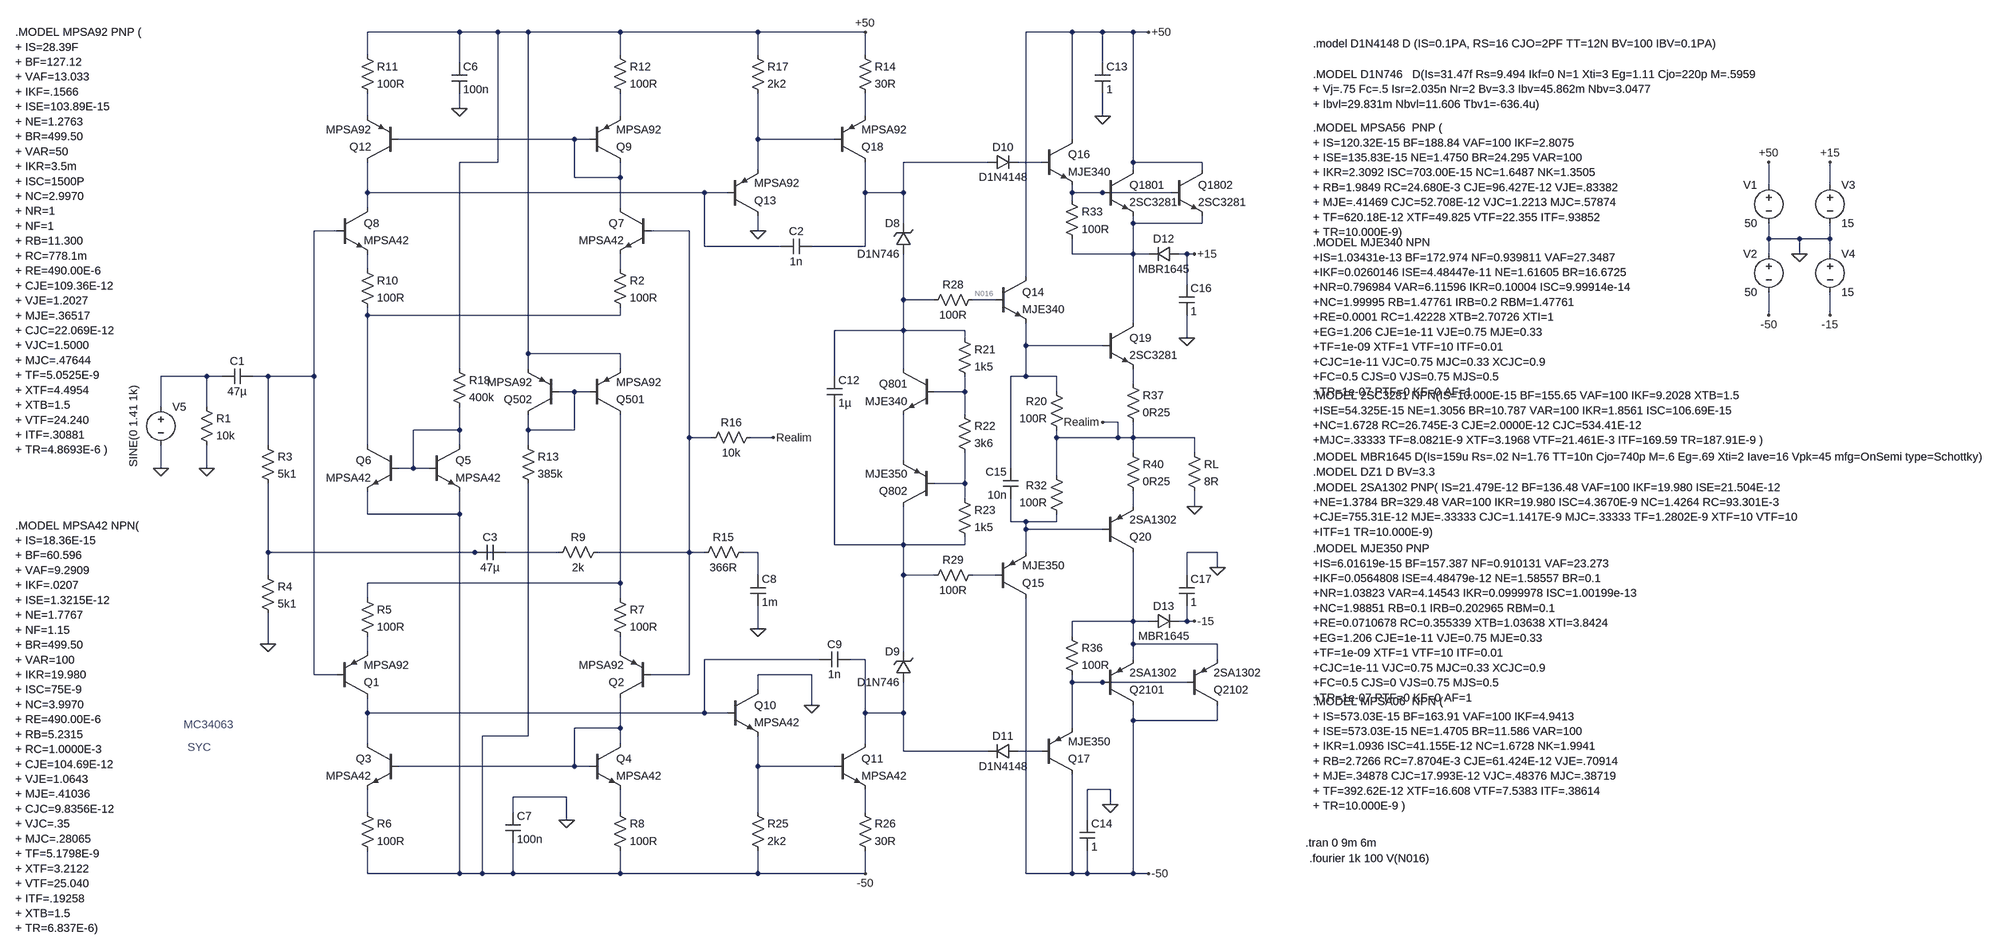
[diagram p0: schematic Clase G doble par fuente espejo.asc]
Clase G doble par fuente espejo.asc, the LTspice schematic file:
Version 4
SHEET 1 4608 680
WIRE 832 -1584 640 -1584
WIRE 912 -1584 832 -1584
WIRE 976 -1584 912 -1584
WIRE 1168 -1584 976 -1584
WIRE 1456 -1584 1168 -1584
WIRE 1680 -1584 1456 -1584
WIRE 2112 -1584 2016 -1584
WIRE 2176 -1584 2112 -1584
WIRE 2240 -1584 2176 -1584
WIRE 2272 -1584 2240 -1584
WIRE 640 -1536 640 -1584
WIRE 1168 -1536 1168 -1584
WIRE 1456 -1536 1456 -1584
WIRE 1680 -1536 1680 -1584
WIRE 832 -1520 832 -1584
WIRE 2176 -1520 2176 -1584
WIRE 832 -1424 832 -1456
WIRE 640 -1408 640 -1456
WIRE 1168 -1408 1168 -1456
WIRE 1680 -1408 1680 -1456
WIRE 2176 -1408 2176 -1456
WIRE 1072 -1360 704 -1360
WIRE 1104 -1360 1072 -1360
WIRE 1456 -1360 1456 -1456
WIRE 1616 -1360 1456 -1360
WIRE 2112 -1360 2112 -1584
WIRE 912 -1312 912 -1584
WIRE 912 -1312 832 -1312
WIRE 1936 -1312 1760 -1312
WIRE 2048 -1312 2000 -1312
WIRE 2240 -1312 2240 -1584
WIRE 2384 -1312 2240 -1312
WIRE 1456 -1296 1456 -1360
WIRE 2240 -1296 2240 -1312
WIRE 2384 -1296 2384 -1312
WIRE 1072 -1280 1072 -1360
WIRE 1168 -1280 1168 -1312
WIRE 1168 -1280 1072 -1280
WIRE 3568 -1264 3568 -1312
WIRE 3696 -1264 3696 -1312
WIRE 640 -1248 640 -1312
WIRE 1344 -1248 640 -1248
WIRE 1392 -1248 1344 -1248
WIRE 1680 -1248 1680 -1312
WIRE 1760 -1248 1760 -1312
WIRE 1760 -1248 1680 -1248
WIRE 2112 -1248 2112 -1264
WIRE 2176 -1248 2112 -1248
WIRE 2320 -1248 2176 -1248
WIRE 2112 -1232 2112 -1248
WIRE 640 -1216 640 -1248
WIRE 1168 -1216 1168 -1280
WIRE 1760 -1184 1760 -1248
WIRE 2240 -1184 2240 -1200
WIRE 2384 -1184 2384 -1200
WIRE 2384 -1184 2240 -1184
WIRE 576 -1168 528 -1168
WIRE 1312 -1168 1232 -1168
WIRE 1456 -1168 1456 -1200
WIRE 3568 -1152 3568 -1184
WIRE 3632 -1152 3568 -1152
WIRE 3696 -1152 3696 -1184
WIRE 3696 -1152 3632 -1152
WIRE 1344 -1136 1344 -1248
WIRE 1504 -1136 1344 -1136
WIRE 1680 -1136 1680 -1248
WIRE 1680 -1136 1568 -1136
WIRE 2112 -1120 2112 -1152
WIRE 2240 -1120 2240 -1184
WIRE 2240 -1120 2112 -1120
WIRE 2272 -1120 2240 -1120
WIRE 2352 -1120 2336 -1120
WIRE 2368 -1120 2352 -1120
WIRE 3568 -1120 3568 -1152
WIRE 3632 -1120 3632 -1152
WIRE 3696 -1120 3696 -1152
WIRE 640 -1088 640 -1120
WIRE 1168 -1088 1168 -1120
WIRE 2016 -1072 2016 -1584
WIRE 2352 -1056 2352 -1120
WIRE 1760 -1024 1760 -1120
WIRE 1824 -1024 1760 -1024
WIRE 1952 -1024 1904 -1024
WIRE 640 -992 640 -1008
WIRE 1168 -992 1168 -1008
WIRE 1168 -992 640 -992
WIRE 3568 -992 3568 -1040
WIRE 3696 -992 3696 -1040
WIRE 2240 -976 2240 -1120
WIRE 1760 -960 1760 -1024
WIRE 1760 -960 1616 -960
WIRE 1888 -960 1760 -960
WIRE 1888 -944 1888 -960
WIRE 2352 -944 2352 -992
WIRE 2016 -928 2016 -976
WIRE 2176 -928 2016 -928
WIRE 976 -912 976 -1584
WIRE 1168 -912 976 -912
WIRE 832 -880 832 -1312
WIRE 976 -880 976 -912
WIRE 1168 -880 1168 -912
WIRE 1760 -880 1760 -960
WIRE 304 -864 208 -864
WIRE 336 -864 304 -864
WIRE 432 -864 400 -864
WIRE 528 -864 528 -1168
WIRE 528 -864 432 -864
WIRE 1616 -864 1616 -960
WIRE 2016 -864 2016 -928
WIRE 2016 -864 1984 -864
WIRE 2080 -864 2016 -864
WIRE 2240 -848 2240 -880
WIRE 1072 -832 1040 -832
WIRE 1104 -832 1072 -832
WIRE 1888 -832 1888 -864
WIRE 1888 -832 1824 -832
WIRE 2080 -832 2080 -864
WIRE 208 -800 208 -864
WIRE 304 -800 304 -864
WIRE 1888 -784 1888 -832
WIRE 2208 -768 2176 -768
WIRE 832 -752 832 -800
WIRE 832 -752 736 -752
WIRE 976 -752 976 -784
WIRE 1072 -752 1072 -832
WIRE 1072 -752 976 -752
WIRE 1312 -736 1312 -1168
WIRE 1360 -736 1312 -736
WIRE 1488 -736 1440 -736
WIRE 2080 -736 2080 -752
WIRE 2208 -736 2208 -768
WIRE 2208 -736 2080 -736
WIRE 2240 -736 2240 -768
WIRE 2240 -736 2208 -736
WIRE 2368 -736 2240 -736
WIRE 432 -720 432 -864
WIRE 640 -720 640 -992
WIRE 832 -720 832 -752
WIRE 976 -720 976 -752
WIRE 2240 -704 2240 -736
WIRE 2368 -704 2368 -736
WIRE 1760 -688 1760 -784
WIRE 208 -672 208 -720
WIRE 304 -672 304 -720
WIRE 736 -672 736 -752
WIRE 736 -672 704 -672
WIRE 768 -672 736 -672
WIRE 1984 -672 1984 -864
WIRE 2080 -656 2080 -736
WIRE 1888 -640 1888 -704
WIRE 1888 -640 1824 -640
WIRE 1888 -608 1888 -640
WIRE 2240 -592 2240 -624
WIRE 2368 -592 2368 -624
WIRE 640 -576 640 -624
WIRE 832 -576 832 -624
WIRE 832 -576 640 -576
WIRE 1984 -560 1984 -608
WIRE 2016 -560 1984 -560
WIRE 2080 -560 2080 -576
WIRE 2080 -560 2016 -560
WIRE 2016 -544 2016 -560
WIRE 2176 -544 2016 -544
WIRE 1616 -512 1616 -800
WIRE 1760 -512 1760 -592
WIRE 1760 -512 1616 -512
WIRE 1888 -512 1888 -528
WIRE 1888 -512 1760 -512
WIRE 432 -496 432 -640
WIRE 864 -496 432 -496
WIRE 912 -496 864 -496
WIRE 1040 -496 928 -496
WIRE 1312 -496 1312 -736
WIRE 1312 -496 1120 -496
WIRE 1344 -496 1312 -496
WIRE 1456 -496 1424 -496
WIRE 2016 -496 2016 -544
WIRE 2416 -496 2352 -496
WIRE 2416 -464 2416 -496
WIRE 432 -448 432 -496
WIRE 1456 -448 1456 -496
WIRE 1760 -448 1760 -512
WIRE 1824 -448 1760 -448
WIRE 1952 -448 1904 -448
WIRE 2352 -448 2352 -496
WIRE 1168 -432 1168 -784
WIRE 1168 -432 640 -432
WIRE 640 -400 640 -432
WIRE 1168 -400 1168 -432
WIRE 2240 -352 2240 -496
WIRE 2240 -352 2112 -352
WIRE 2272 -352 2240 -352
WIRE 2352 -352 2352 -384
WIRE 2352 -352 2336 -352
WIRE 2368 -352 2352 -352
WIRE 1456 -336 1456 -384
WIRE 2112 -320 2112 -352
WIRE 432 -304 432 -368
WIRE 2240 -304 2240 -352
WIRE 2416 -304 2240 -304
WIRE 640 -288 640 -320
WIRE 1168 -288 1168 -320
WIRE 1760 -288 1760 -448
WIRE 1584 -272 1344 -272
WIRE 1680 -272 1648 -272
WIRE 2240 -272 2240 -304
WIRE 2416 -272 2416 -304
WIRE 528 -240 528 -864
WIRE 576 -240 528 -240
WIRE 1312 -240 1312 -496
WIRE 1312 -240 1232 -240
WIRE 1568 -240 1456 -240
WIRE 2112 -224 2112 -240
WIRE 2176 -224 2112 -224
WIRE 2352 -224 2176 -224
WIRE 1456 -208 1456 -240
WIRE 1568 -176 1568 -240
WIRE 640 -160 640 -192
WIRE 1344 -160 1344 -272
WIRE 1344 -160 640 -160
WIRE 1392 -160 1344 -160
WIRE 1680 -160 1680 -272
WIRE 1760 -160 1760 -224
WIRE 1760 -160 1680 -160
WIRE 2240 -144 2240 -176
WIRE 2416 -144 2416 -176
WIRE 2416 -144 2240 -144
WIRE 1168 -128 1168 -192
WIRE 1168 -128 1072 -128
WIRE 2112 -128 2112 -224
WIRE 976 -112 976 -640
WIRE 976 -112 880 -112
WIRE 640 -96 640 -160
WIRE 1168 -96 1168 -128
WIRE 1680 -96 1680 -160
WIRE 1760 -80 1760 -160
WIRE 1936 -80 1760 -80
WIRE 2048 -80 2000 -80
WIRE 1072 -48 1072 -128
WIRE 1072 -48 704 -48
WIRE 1104 -48 1072 -48
WIRE 1456 -48 1456 -112
WIRE 1616 -48 1456 -48
WIRE 2192 0 2144 0
WIRE 1056 16 944 16
WIRE 2192 32 2192 0
WIRE 640 48 640 0
WIRE 944 48 944 16
WIRE 1168 48 1168 0
WIRE 1456 48 1456 -48
WIRE 1680 48 1680 0
WIRE 1056 64 1056 16
WIRE 2144 64 2144 0
WIRE 640 176 640 128
WIRE 832 176 832 -576
WIRE 832 176 640 176
WIRE 880 176 880 -112
WIRE 880 176 832 176
WIRE 944 176 944 112
WIRE 944 176 880 176
WIRE 1168 176 1168 128
WIRE 1168 176 944 176
WIRE 1456 176 1456 128
WIRE 1456 176 1168 176
WIRE 1680 176 1680 128
WIRE 1680 176 1456 176
WIRE 2016 176 2016 -400
WIRE 2112 176 2112 -32
WIRE 2112 176 2016 176
WIRE 2144 176 2144 128
WIRE 2144 176 2112 176
WIRE 2240 176 2240 -144
WIRE 2240 176 2144 176
WIRE 2272 176 2240 176
FLAG 2368 -592 0
FLAG 2272 176 -50
FLAG 2368 -352 -15
FLAG 2272 -1584 +50
FLAG 2368 -1120 +15
FLAG 3568 -1312 +50
FLAG 3568 -992 -50
FLAG 3696 -1312 +15
FLAG 3696 -992 -15
FLAG 3632 -1120 0
FLAG 1568 -176 0
FLAG 208 -672 0
FLAG 432 -304 0
FLAG 1456 -336 0
FLAG 304 -672 0
FLAG 1488 -736 Realim
FLAG 2176 -768 Realim
FLAG 1056 64 0
FLAG 2192 32 0
FLAG 2352 -944 0
FLAG 2416 -464 0
FLAG 2176 -1408 0
FLAG 832 -1424 0
FLAG 1456 -1168 0
FLAG 1680 -1584 +50
FLAG 1680 176 -50
SYMBOL npn 2176 -1296 R0
SYMATTR InstName Q1801
SYMATTR Value 2SC3281
SYMBOL npn 2048 -1360 R0
SYMATTR InstName Q16
SYMATTR Value MJE340
SYMBOL res 2096 -1248 R0
SYMATTR InstName R33
SYMATTR Value 100R
SYMBOL diode 2336 -1136 R90
WINDOW 0 0 32 VBottom 2
WINDOW 3 32 32 VTop 2
SYMATTR InstName D12
SYMATTR Value MBR1645
SYMBOL diode 1936 -1296 R270
WINDOW 0 32 32 VTop 2
WINDOW 3 0 32 VBottom 2
SYMATTR InstName D10
SYMATTR Value D1N4148
SYMBOL zener 1776 -1120 R180
WINDOW 0 24 64 Left 2
WINDOW 3 24 0 Left 2
SYMATTR InstName D8
SYMATTR Value D1N746
SYMBOL npn 1952 -1072 R0
SYMATTR InstName Q14
SYMATTR Value MJE340
SYMBOL npn 2176 -976 R0
SYMATTR InstName Q19
SYMATTR Value 2SC3281
SYMBOL res 2224 -864 R0
SYMATTR InstName R37
SYMATTR Value 0R25
SYMBOL res 2096 -736 R180
WINDOW 0 36 76 Left 2
WINDOW 3 36 40 Left 2
SYMATTR InstName R20
SYMATTR Value 100R
SYMBOL res 2352 -720 R0
SYMATTR InstName RL
SYMATTR Value 8R
SYMBOL res 2224 -720 R0
SYMATTR InstName R40
SYMATTR Value 0R25
SYMBOL pnp 2176 -496 M180
SYMATTR InstName Q20
SYMATTR Value 2SA1302
SYMBOL pnp 1952 -400 M180
SYMATTR InstName Q15
SYMATTR Value MJE350
SYMBOL pnp 2176 -176 M180
SYMATTR InstName Q2101
SYMATTR Value 2SA1302
SYMBOL pnp 2048 -32 M180
SYMATTR InstName Q17
SYMATTR Value MJE350
SYMBOL res 2096 -336 R0
SYMATTR InstName R36
SYMATTR Value 100R
SYMBOL zener 1776 -224 R180
WINDOW 0 24 64 Left 2
WINDOW 3 24 0 Left 2
SYMATTR InstName D9
SYMATTR Value D1N746
SYMBOL diode 2000 -96 R90
WINDOW 0 0 32 VBottom 2
WINDOW 3 32 32 VTop 2
SYMATTR InstName D11
SYMATTR Value D1N4148
SYMBOL diode 2272 -336 R270
WINDOW 0 32 32 VTop 2
WINDOW 3 0 32 VBottom 2
SYMATTR InstName D13
SYMATTR Value MBR1645
SYMBOL res 1920 -1040 R90
WINDOW 0 0 56 VBottom 2
WINDOW 3 32 56 VTop 2
SYMATTR InstName R28
SYMATTR Value 100R
SYMBOL res 1920 -464 R90
WINDOW 0 0 56 VBottom 2
WINDOW 3 32 56 VTop 2
SYMATTR InstName R29
SYMATTR Value 100R
SYMBOL npn 1824 -880 M0
SYMATTR InstName Q801
SYMATTR Value MJE340
SYMBOL pnp 1824 -592 R180
SYMATTR InstName Q802
SYMATTR Value MJE350
SYMBOL res 1872 -960 R0
SYMATTR InstName R21
SYMATTR Value 1k5
SYMBOL res 1872 -800 R0
SYMATTR InstName R22
SYMATTR Value 3k6
SYMBOL res 1872 -624 R0
SYMATTR InstName R23
SYMATTR Value 1k5
SYMBOL voltage 3568 -1280 M0
SYMATTR InstName V1
SYMATTR Value 50
SYMBOL voltage 3568 -1136 M0
SYMATTR InstName V2
SYMATTR Value 50
SYMBOL voltage 3696 -1280 R0
SYMATTR InstName V3
SYMATTR Value 15
SYMBOL voltage 3696 -1136 R0
SYMATTR InstName V4
SYMATTR Value 15
SYMBOL npn 1616 -96 R0
SYMATTR InstName Q11
SYMATTR Value MPSA42
SYMBOL res 1664 32 R0
SYMATTR InstName R26
SYMATTR Value 30R
SYMBOL npn 1392 -208 R0
SYMATTR InstName Q10
SYMATTR Value MPSA42
SYMBOL res 1440 32 R0
SYMATTR InstName R25
SYMATTR Value 2k2
SYMBOL res 2096 -560 R180
WINDOW 0 36 76 Left 2
WINDOW 3 36 40 Left 2
SYMATTR InstName R32
SYMATTR Value 100R
SYMBOL npn 1104 -96 R0
SYMATTR InstName Q4
SYMATTR Value MPSA42
SYMBOL npn 704 -96 M0
SYMATTR InstName Q3
SYMATTR Value MPSA42
SYMBOL pnp 1232 -192 R180
SYMATTR InstName Q2
SYMATTR Value MPSA92
SYMBOL voltage 208 -816 R0
WINDOW 123 -165 100 Left 2
WINDOW 39 0 0 Left 2
WINDOW 3 -57 -30 VRight 2
SYMATTR Value SINE(0 1.41 1k)
SYMATTR InstName V5
SYMBOL pnp 576 -192 M180
SYMATTR InstName Q1
SYMATTR Value MPSA92
SYMBOL res 1152 32 R0
SYMATTR InstName R8
SYMATTR Value 100R
SYMBOL res 624 -416 R0
SYMATTR InstName R5
SYMATTR Value 100R
SYMBOL res 1152 -416 R0
SYMATTR InstName R7
SYMATTR Value 100R
SYMBOL res 624 32 R0
SYMATTR InstName R6
SYMATTR Value 100R
SYMBOL pnp 1040 -784 R180
SYMATTR InstName Q502
SYMATTR Value MPSA92
SYMBOL pnp 1104 -784 M180
SYMATTR InstName Q501
SYMATTR Value MPSA92
SYMBOL res 1328 -480 R270
WINDOW 0 32 56 VTop 2
WINDOW 3 0 56 VBottom 2
SYMATTR InstName R15
SYMATTR Value 366R
SYMBOL res 1456 -752 R90
WINDOW 0 0 56 VBottom 2
WINDOW 3 32 56 VTop 2
SYMATTR InstName R16
SYMATTR Value 10k
SYMBOL res 416 -736 R0
SYMATTR InstName R3
SYMATTR Value 5k1
SYMBOL cap 1440 -448 R0
SYMATTR InstName C8
SYMATTR Value 1m
SYMBOL cap 400 -880 R90
WINDOW 0 0 32 VBottom 2
WINDOW 3 32 32 VTop 2
SYMATTR InstName C1
SYMATTR Value 47µ
SYMBOL cap 1648 -288 R90
WINDOW 0 0 32 VBottom 2
WINDOW 3 32 32 VTop 2
SYMATTR InstName C9
SYMATTR Value 1n
SYMBOL cap 1600 -864 R0
SYMATTR InstName C12
SYMATTR Value 1µ
SYMBOL res 416 -464 R0
SYMATTR InstName R4
SYMATTR Value 5k1
SYMBOL cap 928 -512 R90
WINDOW 0 0 32 VBottom 2
WINDOW 3 32 32 VTop 2
SYMATTR InstName C3
SYMATTR Value 47µ
SYMBOL res 1136 -512 R90
WINDOW 0 0 56 VBottom 2
WINDOW 3 32 56 VTop 2
SYMATTR InstName R9
SYMATTR Value 2k
SYMBOL res 288 -816 R0
SYMATTR InstName R1
SYMATTR Value 10k
SYMBOL cap 2000 -608 R180
WINDOW 0 24 56 Left 2
WINDOW 3 24 8 Left 2
SYMATTR InstName C15
SYMATTR Value 10n
SYMBOL npn 2320 -1296 R0
SYMATTR InstName Q1802
SYMATTR Value 2SC3281
SYMBOL pnp 2352 -176 M180
SYMATTR InstName Q2102
SYMATTR Value 2SA1302
SYMBOL cap 928 48 R0
SYMATTR InstName C7
SYMATTR Value 100n
SYMBOL cap 2128 64 R0
SYMATTR InstName C14
SYMATTR Value 1
SYMBOL cap 2336 -1056 R0
SYMATTR InstName C16
SYMATTR Value 1
SYMBOL cap 2336 -448 R0
SYMATTR InstName C17
SYMATTR Value 1
SYMBOL cap 2160 -1520 R0
SYMATTR InstName C13
SYMATTR Value 1
SYMBOL cap 816 -1520 R0
SYMATTR InstName C6
SYMATTR Value 100n
SYMBOL npn 768 -720 R0
SYMATTR InstName Q5
SYMATTR Value MPSA42
SYMBOL npn 704 -720 M0
SYMATTR InstName Q6
SYMATTR Value MPSA42
SYMBOL npn 1232 -1216 M0
SYMATTR InstName Q7
SYMATTR Value MPSA42
SYMBOL npn 576 -1216 R0
SYMATTR InstName Q8
SYMATTR Value MPSA42
SYMBOL res 1152 -1104 R0
SYMATTR InstName R2
SYMATTR Value 100R
SYMBOL res 624 -1104 R0
SYMATTR InstName R10
SYMATTR Value 100R
SYMBOL pnp 1104 -1312 M180
SYMATTR InstName Q9
SYMATTR Value MPSA92
SYMBOL pnp 704 -1312 R180
SYMATTR InstName Q12
SYMATTR Value MPSA92
SYMBOL res 624 -1552 R0
SYMATTR InstName R11
SYMATTR Value 100R
SYMBOL res 1152 -1552 R0
SYMATTR InstName R12
SYMATTR Value 100R
SYMBOL pnp 1392 -1200 M180
SYMATTR InstName Q13
SYMATTR Value MPSA92
SYMBOL pnp 1616 -1312 M180
SYMATTR InstName Q18
SYMATTR Value MPSA92
SYMBOL cap 1568 -1152 R90
WINDOW 0 0 32 VBottom 2
WINDOW 3 32 32 VTop 2
SYMATTR InstName C2
SYMATTR Value 1n
SYMBOL res 1664 -1552 R0
SYMATTR InstName R14
SYMATTR Value 30R
SYMBOL res 1440 -1552 R0
SYMATTR InstName R17
SYMATTR Value 2k2
SYMBOL res 960 -736 R0
SYMATTR InstName R13
SYMATTR Value 385k
SYMBOL res 816 -896 R0
SYMATTR InstName R18
SYMATTR Value 400k
TEXT 2616 -664 Left 2 !.MODEL DZ1 D BV=3.3
TEXT 2616 -1384 Left 2 !.MODEL MPSA56  PNP (\n+ IS=120.32E-15 BF=188.84 VAF=100 IKF=2.8075\n+ ISE=135.83E-15 NE=1.4750 BR=24.295 VAR=100\n+ IKR=2.3092 ISC=703.00E-15 NC=1.6487 NK=1.3505\n+ RB=1.9849 RC=24.680E-3 CJE=96.427E-12 VJE=.83382\n+ MJE=.41469 CJC=52.708E-12 VJC=1.2213 MJC=.57874\n+ TF=620.18E-12 XTF=49.825 VTF=22.355 ITF=.93852\n+ TR=10.000E-9)
TEXT 2616 -1144 Left 2 !.MODEL MJE340 NPN\n+IS=1.03431e-13 BF=172.974 NF=0.939811 VAF=27.3487\n+IKF=0.0260146 ISE=4.48447e-11 NE=1.61605 BR=16.6725\n+NR=0.796984 VAR=6.11596 IKR=0.10004 ISC=9.99914e-14\n+NC=1.99995 RB=1.47761 IRB=0.2 RBM=1.47761\n+RE=0.0001 RC=1.42228 XTB=2.70726 XTI=1\n+EG=1.206 CJE=1e-11 VJE=0.75 MJE=0.33\n+TF=1e-09 XTF=1 VTF=10 ITF=0.01\n+CJC=1e-11 VJC=0.75 MJC=0.33 XCJC=0.9\n+FC=0.5 CJS=0 VJS=0.75 MJS=0.5\n+TR=1e-07 PTF=0 KF=0 AF=1
TEXT 2616 -824 Left 2 !.MODEL 2SC3281 NPN(IS=10.000E-15 BF=155.65 VAF=100 IKF=9.2028 XTB=1.5\n+ISE=54.325E-15 NE=1.3056 BR=10.787 VAR=100 IKR=1.8561 ISC=106.69E-15\n+NC=1.6728 RC=26.745E-3 CJE=2.0000E-12 CJC=534.41E-12\n+MJC=.33333 TF=8.0821E-9 XTF=3.1968 VTF=21.461E-3 ITF=169.59 TR=187.91E-9 )
TEXT 2616 -696 Left 2 !.MODEL MBR1645 D(Is=159u Rs=.02 N=1.76 TT=10n Cjo=740p M=.6 Eg=.69 Xti=2 Iave=16 Vpk=45 mfg=OnSemi type=Schottky)
TEXT 2616 -632 Left 2 !.MODEL 2SA1302 PNP( IS=21.479E-12 BF=136.48 VAF=100 IKF=19.980 ISE=21.504E-12\n+NE=1.3784 BR=329.48 VAR=100 IKR=19.980 ISC=4.3670E-9 NC=1.4264 RC=93.301E-3\n+CJE=755.31E-12 MJE=.33333 CJC=1.1417E-9 MJC=.33333 TF=1.2802E-9 XTF=10 VTF=10\n+ITF=1 TR=10.000E-9)
TEXT 2616 -504 Left 2 !.MODEL MJE350 PNP\n+IS=6.01619e-15 BF=157.387 NF=0.910131 VAF=23.273\n+IKF=0.0564808 ISE=4.48479e-12 NE=1.58557 BR=0.1\n+NR=1.03823 VAR=4.14543 IKR=0.0999978 ISC=1.00199e-13\n+NC=1.98851 RB=0.1 IRB=0.202965 RBM=0.1\n+RE=0.0710678 RC=0.355339 XTB=1.03638 XTI=3.8424\n+EG=1.206 CJE=1e-11 VJE=0.75 MJE=0.33\n+TF=1e-09 XTF=1 VTF=10 ITF=0.01\n+CJC=1e-11 VJC=0.75 MJC=0.33 XCJC=0.9\n+FC=0.5 CJS=0 VJS=0.75 MJS=0.5\n+TR=1e-07 PTF=0 KF=0 AF=1
TEXT 2616 -184 Left 2 !.MODEL MPSA06  NPN (\n+ IS=573.03E-15 BF=163.91 VAF=100 IKF=4.9413\n+ ISE=573.03E-15 NE=1.4705 BR=11.586 VAR=100\n+ IKR=1.0936 ISC=41.155E-12 NC=1.6728 NK=1.9941\n+ RB=2.7266 RC=7.8704E-3 CJE=61.424E-12 VJE=.70914\n+ MJE=.34878 CJC=17.993E-12 VJC=.48376 MJC=.38719\n+ TF=392.62E-12 XTF=16.608 VTF=7.5383 ITF=.38614\n+ TR=10.000E-9 )
TEXT 2608 144 Left 2 !.fourier 1k 100 V(N016)
TEXT 2600 112 Left 2 !.tran 0 9m 6m
TEXT 2616 -1496 Left 2 !.MODEL D1N746   D(Is=31.47f Rs=9.494 Ikf=0 N=1 Xti=3 Eg=1.11 Cjo=220p M=.5959\n+ Vj=.75 Fc=.5 Isr=2.035n Nr=2 Bv=3.3 Ibv=45.862m Nbv=3.0477\n+ Ibvl=29.831m Nbvl=11.606 Tbv1=-636.4u)
TEXT 2616 -1560 Left 2 !.model D1N4148 D (IS=0.1PA, RS=16 CJO=2PF TT=12N BV=100 IBV=0.1PA)
TEXT -96 -1584 Left 2 !.MODEL MPSA92 PNP (\n+ IS=28.39F\n+ BF=127.12\n+ VAF=13.033\n+ IKF=.1566\n+ ISE=103.89E-15\n+ NE=1.2763\n+ BR=499.50\n+ VAR=50\n+ IKR=3.5m\n+ ISC=1500P\n+ NC=2.9970\n+ NR=1\n+ NF=1\n+ RB=11.300\n+ RC=778.1m\n+ RE=490.00E-6\n+ CJE=109.36E-12\n+ VJE=1.2027\n+ MJE=.36517\n+ CJC=22.069E-12\n+ VJC=1.5000\n+ MJC=.47644\n+ TF=5.0525E-9\n+ XTF=4.4954\n+ XTB=1.5\n+ VTF=24.240\n+ ITF=.30881\n+ TR=4.8693E-6 )
TEXT -96 -552 Left 2 !.MODEL MPSA42 NPN(\n+ IS=18.36E-15\n+ BF=60.596\n+ VAF=9.2909\n+ IKF=.0207\n+ ISE=1.3215E-12\n+ NE=1.7767\n+ NF=1.15\n+ BR=499.50\n+ VAR=100\n+ IKR=19.980\n+ ISC=75E-9\n+ NC=3.9970\n+ RE=490.00E-6\n+ RB=5.2315\n+ RC=1.0000E-3\n+ CJE=104.69E-12\n+ VJE=1.0643\n+ MJE=.41036\n+ CJC=9.8356E-12\n+ VJC=.35\n+ MJC=.28065\n+ TF=5.1798E-9\n+ XTF=3.2122\n+ VTF=25.040\n+ ITF=.19258\n+ XTB=1.5\n+ TR=6.837E-6)
TEXT 256 -136 Left 2 ;MC34063
TEXT 264 -88 Left 2 ;SYC

The netlist it stands for:
* Clase G doble par fuente espejo.asc
Q1801 +50 N009 N010 0 2SC3281
Q16 +50 N007 N009 0 MJE340
R33 N009 N010 100R
D12 +15 N010 MBR1645
D10 N006 N007 D1N4148
D8 N015 N006 D1N746
Q14 +50 N016 N018 0 MJE340
Q19 N010 N018 N020 0 2SC3281
R37 N020 Realim 0R25
R20 Realim N018 100R
RL Realim 0 8R
R40 Realim N026 0R25
Q20 N034 N027 N026 0 2SA1302
Q15 -50 N032 N027 0 MJE350
Q2101 -50 N039 N034 0 2SA1302
Q17 -50 N041 N039 0 MJE350
R36 N034 N039 100R
D9 N038 N028 D1N746
D11 N041 N038 D1N4148
D13 N034 -15 MBR1645
R28 N016 N015 100R
R29 N032 N028 100R
Q801 N015 N022 N024 0 MJE340
Q802 N028 N025 N024 0 MJE350
R21 N015 N022 1k5
R22 N022 N025 3k6
R23 N025 N028 1k5
V1 +50 0 50
V2 0 -50 50
V3 +15 0 15
V4 0 -15 15
Q11 N038 N042 N045 0 MPSA42
R26 N045 -50 30R
Q10 0 N037 N042 0 MPSA42
R25 N042 -50 2k2
R32 N027 Realim 100R
Q4 N040 N040 N044 0 MPSA42
Q3 N037 N040 N043 0 MPSA42
Q2 N040 N012 N036 0 MPSA92
V5 N019 0 SINE(0 1.41 1k)
Q1 N037 N011 N035 0 MPSA92
R8 N044 -50 100R
R5 N033 N035 100R
R7 N033 N036 100R
R6 N043 -50 100R
Q502 N021 N021 +50 0 MPSA92
Q501 N033 N021 +50 0 MPSA92
R15 N012 N031 366R
R16 Realim N012 10k
R3 N011 N029 5k1
C8 N031 0 1m
C1 N011 N019 47µ
C9 N038 N037 1n
C12 N015 N028 1µ
R4 N029 0 5k1
C3 N030 N029 47µ
R9 N012 N030 2k
R1 N019 0 10k
C15 N027 N018 10n
Q1802 +50 N009 N010 0 2SC3281
Q2102 -50 N039 N034 0 2SA1302
C7 0 -50 100n
C14 0 -50 1
C16 +15 0 1
C17 0 -15 1
C13 +50 0 1
C6 +50 0 100n
Q5 N023 N023 -50 0 MPSA42
Q6 N017 N023 -50 0 MPSA42
Q7 N004 N012 N014 0 MPSA42
Q8 N008 N011 N013 0 MPSA42
R2 N014 N017 100R
R10 N013 N017 100R
Q9 N004 N004 N002 0 MPSA92
Q12 N008 N004 N001 0 MPSA92
R11 +50 N001 100R
R12 +50 N002 100R
Q13 0 N008 N005 0 MPSA92
Q18 N006 N005 N003 0 MPSA92
C2 N006 N008 1n
R14 +50 N003 30R
R17 +50 N005 2k2
R13 N021 -50 385k
R18 +50 N023 400k
.model D D
.lib standard.dio
.model NPN NPN
.model PNP PNP
.lib standard.bjt
.MODEL DZ1 D BV=3.3
.MODEL MPSA56  PNP (
+ IS=120.32E-15 BF=188.84 VAF=100 IKF=2.8075
+ ISE=135.83E-15 NE=1.4750 BR=24.295 VAR=100
+ IKR=2.3092 ISC=703.00E-15 NC=1.6487 NK=1.3505
+ RB=1.9849 RC=24.680E-3 CJE=96.427E-12 VJE=.83382
+ MJE=.41469 CJC=52.708E-12 VJC=1.2213 MJC=.57874
+ TF=620.18E-12 XTF=49.825 VTF=22.355 ITF=.93852
+ TR=10.000E-9)
.MODEL MJE340 NPN
+IS=1.03431e-13 BF=172.974 NF=0.939811 VAF=27.3487
+IKF=0.0260146 ISE=4.48447e-11 NE=1.61605 BR=16.6725
+NR=0.796984 VAR=6.11596 IKR=0.10004 ISC=9.99914e-14
+NC=1.99995 RB=1.47761 IRB=0.2 RBM=1.47761
+RE=0.0001 RC=1.42228 XTB=2.70726 XTI=1
+EG=1.206 CJE=1e-11 VJE=0.75 MJE=0.33
+TF=1e-09 XTF=1 VTF=10 ITF=0.01
+CJC=1e-11 VJC=0.75 MJC=0.33 XCJC=0.9
+FC=0.5 CJS=0 VJS=0.75 MJS=0.5
+TR=1e-07 PTF=0 KF=0 AF=1
.MODEL 2SC3281 NPN(IS=10.000E-15 BF=155.65 VAF=100 IKF=9.2028 XTB=1.5
+ISE=54.325E-15 NE=1.3056 BR=10.787 VAR=100 IKR=1.8561 ISC=106.69E-15
+NC=1.6728 RC=26.745E-3 CJE=2.0000E-12 CJC=534.41E-12
+MJC=.33333 TF=8.0821E-9 XTF=3.1968 VTF=21.461E-3 ITF=169.59 TR=187.91E-9 )
.MODEL MBR1645 D(Is=159u Rs=.02 N=1.76 TT=10n Cjo=740p M=.6 Eg=.69 Xti=2 Iave=16 Vpk=45 mfg=OnSemi type=Schottky)
.MODEL 2SA1302 PNP( IS=21.479E-12 BF=136.48 VAF=100 IKF=19.980 ISE=21.504E-12
+NE=1.3784 BR=329.48 VAR=100 IKR=19.980 ISC=4.3670E-9 NC=1.4264 RC=93.301E-3
+CJE=755.31E-12 MJE=.33333 CJC=1.1417E-9 MJC=.33333 TF=1.2802E-9 XTF=10 VTF=10
+ITF=1 TR=10.000E-9)
.MODEL MJE350 PNP
+IS=6.01619e-15 BF=157.387 NF=0.910131 VAF=23.273
+IKF=0.0564808 ISE=4.48479e-12 NE=1.58557 BR=0.1
+NR=1.03823 VAR=4.14543 IKR=0.0999978 ISC=1.00199e-13
+NC=1.98851 RB=0.1 IRB=0.202965 RBM=0.1
+RE=0.0710678 RC=0.355339 XTB=1.03638 XTI=3.8424
+EG=1.206 CJE=1e-11 VJE=0.75 MJE=0.33
+TF=1e-09 XTF=1 VTF=10 ITF=0.01
+CJC=1e-11 VJC=0.75 MJC=0.33 XCJC=0.9
+FC=0.5 CJS=0 VJS=0.75 MJS=0.5
+TR=1e-07 PTF=0 KF=0 AF=1
.MODEL MPSA06  NPN (
+ IS=573.03E-15 BF=163.91 VAF=100 IKF=4.9413
+ ISE=573.03E-15 NE=1.4705 BR=11.586 VAR=100
+ IKR=1.0936 ISC=41.155E-12 NC=1.6728 NK=1.9941
+ RB=2.7266 RC=7.8704E-3 CJE=61.424E-12 VJE=.70914
+ MJE=.34878 CJC=17.993E-12 VJC=.48376 MJC=.38719
+ TF=392.62E-12 XTF=16.608 VTF=7.5383 ITF=.38614
+ TR=10.000E-9 )
.fourier 1k 100 V(N016)
.tran 0 9m 6m
.MODEL D1N746   D(Is=31.47f Rs=9.494 Ikf=0 N=1 Xti=3 Eg=1.11 Cjo=220p M=.5959
+ Vj=.75 Fc=.5 Isr=2.035n Nr=2 Bv=3.3 Ibv=45.862m Nbv=3.0477
+ Ibvl=29.831m Nbvl=11.606 Tbv1=-636.4u)
.model D1N4148 D (IS=0.1PA, RS=16 CJO=2PF TT=12N BV=100 IBV=0.1PA)
.MODEL MPSA92 PNP (
+ IS=28.39F
+ BF=127.12
+ VAF=13.033
+ IKF=.1566
+ ISE=103.89E-15
+ NE=1.2763
+ BR=499.50
+ VAR=50
+ IKR=3.5m
+ ISC=1500P
+ NC=2.9970
+ NR=1
+ NF=1
+ RB=11.300
+ RC=778.1m
+ RE=490.00E-6
+ CJE=109.36E-12
+ VJE=1.2027
+ MJE=.36517
+ CJC=22.069E-12
+ VJC=1.5000
+ MJC=.47644
+ TF=5.0525E-9
+ XTF=4.4954
+ XTB=1.5
+ VTF=24.240
+ ITF=.30881
+ TR=4.8693E-6 )
.MODEL MPSA42 NPN(
+ IS=18.36E-15
+ BF=60.596
+ VAF=9.2909
+ IKF=.0207
+ ISE=1.3215E-12
+ NE=1.7767
+ NF=1.15
+ BR=499.50
+ VAR=100
+ IKR=19.980
+ ISC=75E-9
+ NC=3.9970
+ RE=490.00E-6
+ RB=5.2315
+ RC=1.0000E-3
+ CJE=104.69E-12
+ VJE=1.0643
+ MJE=.41036
+ CJC=9.8356E-12
+ VJC=.35
+ MJC=.28065
+ TF=5.1798E-9
+ XTF=3.2122
+ VTF=25.040
+ ITF=.19258
+ XTB=1.5
+ TR=6.837E-6)
* MC34063
* SYC
.backanno
.end